# EAGLE schematic Sh2560 (EAGLE 7.7.0)
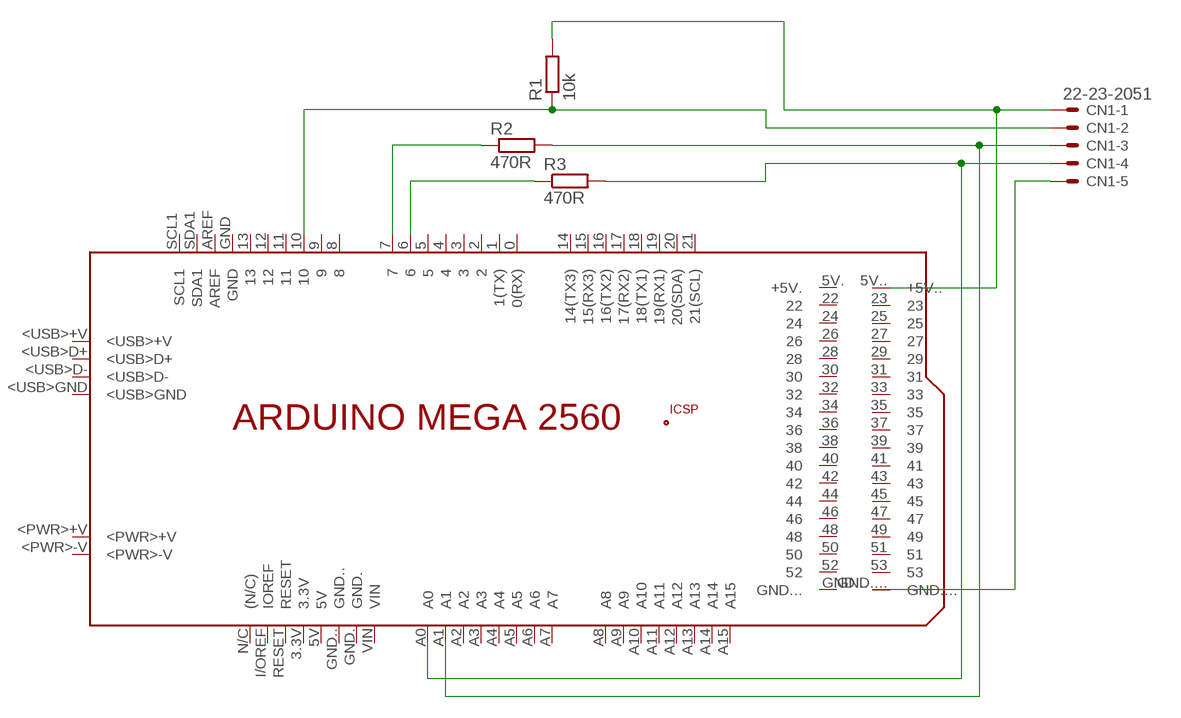
[diagram p0: schematic, sheet 1]

## Parts
CN1  22-23-2051  [22-23-2051]
PCB1  ARDUINO_MEGA2560  [ARDUINO_MEGA2560]
R1  10k  R-EU_0207/5V  [0207/5V]
R2  470R  R-EU_0207/5V  [0207/5V]
R3  470R  R-EU_0207/5V  [0207/5V]

## Nets
N$1: PCB1.6 R3.1
N$2: PCB1.7 R2.1
N$3: CN1.2 PCB1.10 R1.1
N$4: CN1.5 PCB1.GND....
N$5: CN1.1 R1.2
N$6: CN1.4 PCB1.A0 R3.2
N$7: CN1.3 PCB1.A1 R2.2
Unconnected: PCB1.0(0(RX)) PCB1.1(1(TX)) PCB1.2 PCB1.3 PCB1.3.3V PCB1.4 PCB1.5 PCB1.5V PCB1.5V.(+5V.) PCB1.5V..(+5V..) PCB1.8 PCB1.9 PCB1.11 PCB1.12 PCB1.13 PCB1.14(14(TX3)) PCB1.15(15(RX3)) PCB1.16(16(TX2)) PCB1.17(17(RX2)) PCB1.18(18(TX1)) PCB1.19(19(RX1)) PCB1.20(20(SDA)) PCB1.21(21(SCL)) PCB1.22 PCB1.23 PCB1.24 PCB1.25 PCB1.26 PCB1.27 PCB1.28 PCB1.29 PCB1.30 PCB1.31 PCB1.32 PCB1.33 PCB1.34 PCB1.35 PCB1.36 PCB1.37 PCB1.38 PCB1.39 PCB1.40 PCB1.41 PCB1.42 PCB1.43 PCB1.44 PCB1.45 PCB1.46 PCB1.47 PCB1.48 PCB1.49 PCB1.50 PCB1.51 PCB1.52 PCB1.53 PCB1.+5V_ PCB1.<PWR>+V PCB1.<PWR>-V PCB1.<USB>+V PCB1.<USB>D+ PCB1.<USB>D- PCB1.<USB>GND PCB1.A2 PCB1.A3 PCB1.A4 PCB1.A5 PCB1.A6 PCB1.A7 PCB1.A8 PCB1.A9 PCB1.A10 PCB1.A11 PCB1.A12 PCB1.A13 PCB1.A14 PCB1.A15 PCB1.AREF PCB1.GND PCB1.GND. PCB1.GND.. PCB1.GND... PCB1.GND__ PCB1.I/OREF(IOREF) PCB1.MISO PCB1.MOSI PCB1.N/C((N/C)) PCB1.RESET PCB1.RESET. PCB1.SCK PCB1.SCL1 PCB1.SDA1 PCB1.VIN

## Library data of the parts
CN1 = con-molex:22-23-2051: .100" (2.54mm) Center Header - 5 Pin; MF: MOLEX; MPN: 22-23-2051; OC_FARNELL: 1462952; OC_NEWARK: 38C9178
PCB1 = E14_Arduino_revC:ARDUINO_MEGA2560: Device for representing an Arduino Mega 2560 board with a footprint in an EAGLE design. Created by Dave Young for Element14. More EAGLE documentation at: http://www.element14.com/community/community/knode/cadsoft_eagle
R1-R3 = resistor:R-EU_: RESISTOR, European symbol